# Altium schematic sheet Communication.SchDoc
size A3; SheetNumber: 4; SheetTotal: 5
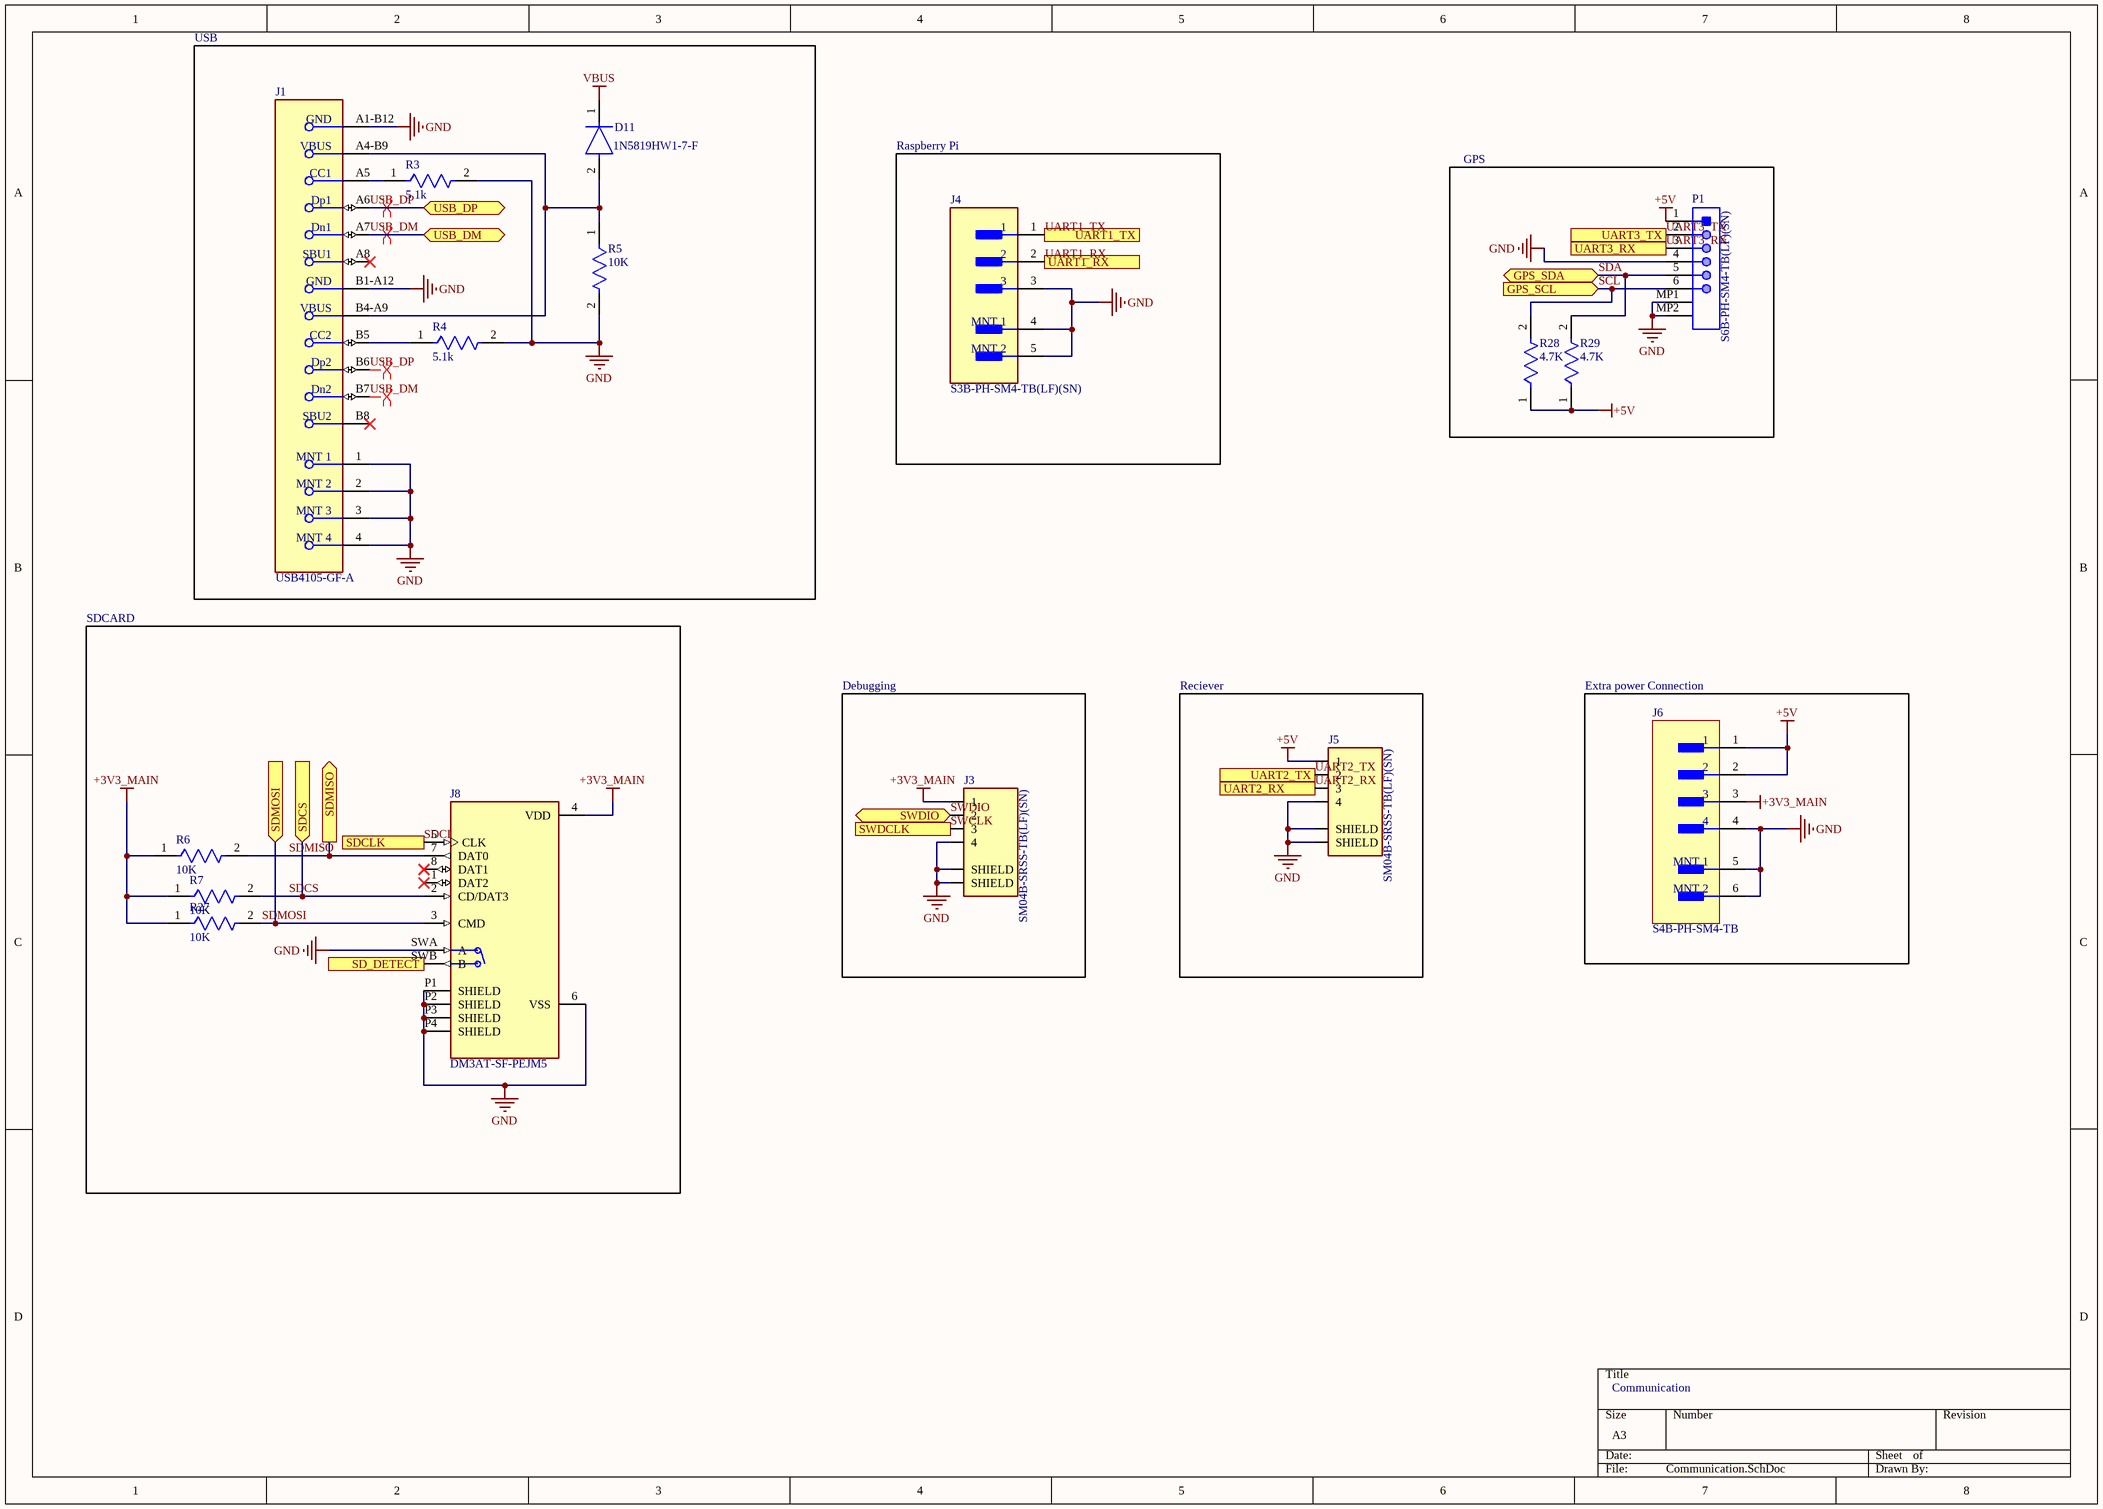
[diagram p0: Communication.SchDoc]

## Parts
D11  1N5819HW1-7-F  [FP-SOD123F_Type_B-MFG]
J1  USB4105-GF-A  [FP-USB4105-GF-A-MFG]
J3  SM04B-SRSS-TB(LF)(SN)  [JST_SM04B-SRSS-TB(LF)(SN)]
J4  S3B-PH-SM4-TB(LF)(SN)  [FP-S3B-PH-SM4-TB_LF_SN-MFG]
J5  SM04B-SRSS-TB(LF)(SN)  [JST_SM04B-SRSS-TB(LF)(SN)]
J6  S4B-PH-SM4-TB  [FP-S4B-PH-SM4-TB-MFG]
J8  DM3AT-SF-PEJM5  [HRS_DM3AT-SF-PEJM5]
P1  S6B-PH-SM4-TB(LF)(SN)  [JST-S6B-PH-SM4-TB(LF)(SN)_V]
R3  5.1k  [FP-RN73R1E-IPC_C]
R4  5.1k  [FP-RN73R1E-IPC_C]
R5  10K  [FP-MCS0402-MFG]
R6  10K  [FP-MCS0402-MFG]
R7  10K  [FP-MCS0402-MFG]
R27  10K  [FP-MCS0402-MFG]
R28  4.7K  [FP-CRCW0402-Pe3-IPC_C]
R29  4.7K  [FP-CRCW0402-Pe3-IPC_C]

## Blocks framed on the sheet
USB: D11 J1 R3-R5
Raspberry Pi: J4
GPS: P1 R28 R29
SDCARD: J8 R6 R7 R27
Debugging: J3
Reciever: J5
Extra power Connection: J6

## Ports
GPS_SCL (in, see EMP_FC_Main[3B], MCU_Core[5B]), GPS_SDA (bidir, see EMP_FC_Main[3B], MCU_Core[5B]), SD_DETECT (out, see EMP_FC_Main[3B], MCU_Core[1B]), SDCLK (in, see EMP_FC_Main[3B], MCU_Core[1B]), SDCS (in, see EMP_FC_Main[3B], MCU_Core[3B]), SDMISO (out, see EMP_FC_Main[3B], MCU_Core[1B]), SDMOSI (in, see EMP_FC_Main[3B], MCU_Core[1B]), SWDCLK (out, see EMP_FC_Main[3B], MCU_Core[4B]), SWDIO (bidir, see EMP_FC_Main[3B], MCU_Core[4B]), UART1_RX (out, see EMP_FC_Main[3B], MCU_Core[3B]), UART1_TX (in, see EMP_FC_Main[3B], MCU_Core[3B]), UART2_RX (out, see EMP_FC_Main[3B], MCU_Core[4B]), UART2_TX (in, see EMP_FC_Main[3B], MCU_Core[4B]), UART3_RX (out, see EMP_FC_Main[3B], MCU_Core[1B]), UART3_TX (in, see EMP_FC_Main[3B], MCU_Core[1B]), USB_DM (bidir, see EMP_FC_Main[3B], MCU_Core[4B]), USB_DP (bidir, see EMP_FC_Main[3B], MCU_Core[4B])

## Nets
+3V3_MAIN: J3.1 J6.3 J8.4(VDD) R6.1 R7.1 R27.1
+5V: J5.1 J6.1 J6.2 P1.1 R28.1 R29.1
GND: J1.1(MNT_1) J1.2(MNT_2) J1.3(MNT_3) J1.4(MNT_4) J1.A1-B12(GND) J1.B1-A12(GND) J3.4 J3.S1(SHIELD) J3.S2(SHIELD) J4.3 J4.4(MNT_1) J4.5(MNT_2) J5.4 J5.S1(SHIELD) J5.S2(SHIELD) J6.4 J6.5(MNT_1) J6.6(MNT_2) J8.6(VSS) J8.P1(SHIELD) J8.P2(SHIELD) J8.P3(SHIELD) J8.P4(SHIELD) J8.SWA(A) P1.4 P1.MP1 P1.MP2 R3.2 R4.2 R5.2
VBUS: D11.1(C)
SCL: P1.6 R28.2 ; port GPS_SCL
SD_DETECT: J8.SWB(B) ; port SD_DETECT
SDA: P1.5 R29.2 ; port GPS_SDA
SDCLK: J8.5(CLK) ; port SDCLK
SDCS: J8.2(CD/DAT3) R7.2 ; port SDCS
SDMISO: J8.7(DAT0) R6.2 ; port SDMISO
SDMOSI: J8.3(CMD) R27.2 ; port SDMOSI
SWCLK: J3.3 ; port SWDCLK
SWDIO: J3.2 ; port SWDIO
UART1_RX: J4.2 ; port UART1_RX
UART1_TX: J4.1 ; port UART1_TX
UART2_RX: J5.3 ; port UART2_RX
UART2_TX: J5.2 ; port UART2_TX
UART3_RX: P1.3 ; port UART3_RX
UART3_TX: P1.2 ; port UART3_TX
USB_DM: J1.A7(Dn1) J1.B7(Dn2) ; port USB_DM
USB_DP: J1.A6(Dp1) J1.B6(Dp2) ; port USB_DP
NetD11_2: D11.2(A) J1.A4-B9(VBUS) J1.B4-A9(VBUS) R5.1
NetJ1_A5: J1.A5(CC1) R3.1
NetJ1_B5: J1.B5(CC2) R4.1

Not connected (* = marked no-connect by the designer): J1 A8(SBU1)* B8(SBU2)*; J8 1(DAT2)* 8(DAT1)*

## Layout directives
differential pair: USB_DM, USB_DP

## Notes on the sheet
- Communication

## Library data of the parts
D11 = CMP-12791-000028-1: DIODE SBR 40V 1A SOD123F; Manufacturer: Diodes Inc.; Max Junction Temp: +125°C; Capacitance: 30pF; Value: 30pF; Peak Reverse Current: 0.5mA; Max Surge Forward Current: 30A; ComponentLink2Description: Datasheet; Temperature: -55°C to +125°C; Lead Free: Yes; Package: SOD123F (Type B); Reverse Voltage: 40V; Device Class L2: Diodes; Manufacturer Part Number: 1N5819HW1-7-F; ComponentLink2URL: https://www.diodes.com/assets/Datasheets/1N5819HW1.pdf; Automotive: No; RoHS: TRUE; Height: 1.15mm; Digikey Description: DIODE SBR 40V 1A SOD123F; Max Repetitive Reverse Voltage: 40V; Forward Current: 1A; Footprint Url: https://www.diodes.com/assets/Package-Files/SOD123F%20(Type%20B).pdf; Temperature Range High: +125°C; Octopart: https://octopart.com/1n5819hw1-7-f-diodes+inc.-67250096; Mouser Description: Schottky Diodes & Rectifiers 1A SBR 40Vrrm 0.51Vf 0.5mA 28Vrms; Device Class L3: Rectifier Diodes; Ipc Land Pattern Name: SOD350180X98-2; Device Class L1: Discrete Semiconductors; Category: Diode; Temperature Range Low: -55°C
J1 = CMP-245163-000001-1: CONN RCPT USB2.0 TYPEC 5A; Manufacturer: GCT; Description: USB - C (Type - C) USB 2.0 Receptacle Connector 24 Position Surface Mount, Right Angle; Through Hole; Voltage Rating: 20V; Is Female: yes; Current Rating: 5/6.25/1.25/0.25A; Number Of Contacts: 16; Conn Orientation: Right Angle; Device Class L1: Connectors; Category: Conn; Lead Free: Yes; RoHS: TRUE; Temperature Range High: +85°C; Digikey Description: CONN RCPT USB2.0 TYPEC 5A; Device Class L3: unset; ComponentLink2Description: Datasheet; Manufacturer Part Number: USB4105-GF-A; Package: 0; Usb Standard: USB 2.0; Device Class L2: USB Connectors; Automotive: No; Temperature Range Low: -40°C; Height: 3.46mm; Temperature: -40°C to +85°C; Contact Material: Gold,Nickel; ComponentLink2URL: https://gct.co/files/drawings/usb4105.pdf; Octopart: https://octopart.com/usb4105-gf-a-gct-106627878
J3 J5 = SM04B-SRSS-TB(LF)(SN): Connector Header Surface Mount, Right Angle 4 position 0.039 (1.00mm); MF: JST Sales; SnapEDA_Link: https://www.snapeda.com/parts/SM04B-SRSS-TB(LF)(SN)/JST/view-part/?ref=snap; Package: None; Value: *; MP: SM04B-SRSS-TB(LF)(SN); Check_prices: https://www.snapeda.com/parts/SM04B-SRSS-TB(LF)(SN)/JST/view-part/?ref=eda
J4 = CMP-2000-07023-2: CONN HEADER SMD R/A 3POS 2MM; Voltage Rating: 100V; Gender: Male; Max Current Rating: 2A; Number of Contacts: 3; Insulation Resistance: 1GR; Contact Resistance: 10mR; Termination: Solder; Orientation: Right Angle; Insulation Color: Natural; Flammability Rating: UL94 V-0; Width: 5mm; Lead Free: Lead Free; Mount: Surface Mount; Max Operating Temperature: 85°C; Connector Type: Header; Fastening Type: Detent; Max Voltage Rating (DC): 100V; Housing Material: Polyamide; Number of Rows: 1; Housing Color: Beige; Contact Plating: Tin; Contact Shape: Square; Working Voltage: 100V; Contact Material: Copper Alloy; Contact Mating Length: 0.13inch; Contact Type: Male Pin; Max Voltage Rating (AC): 100V; Packaging: Tape and Reel; Min Operating Temperature: -25°C; Number of Positions: 3; REACH SVHC: No SVHC; Contact Finish - Mating: TIN; Color: Natural; Length: 9.9mm; Insulation Material: Nylon; Depth: 7.6mm; Current Rating: 2A; Material: Polyamide; Voltage Rating (AC): 100V; Pitch: 2mm; Series: PH; Height: 9.4mm; Number of Poles: 3; Lead Pitch: 2mm
J6 = CMP-00504-08293667-1: S4B-PH-SM4-TB Header S4B-PH-SM4-TB, 2.00mm, 4-contacts, side entry, SMT, /1000/reel; Max Voltage Rating (DC): 100V; Gender: Male; Number of Contacts: 4; Pitch: 2mm; Max Current Rating: 2A; Contact Resistance: 20mΩ; Termination: Solder; Contact Plating: Copper, Tin; Max Voltage Rating (AC): 100V; Number of Pins: 4; Length: 11.9mm; Housing Color: Beige; RoHS: Non-Compliant; Voltage Rating: 100V; Depth: 7.6mm; Height: 5.5mm; Current Rating: 2A; Max Operating Temperature: 85°C; Min Operating Temperature: -25°C; Number of Rows: 1; Housing Material: Polyamide; Contact Material: Copper, Tin; Packaging: Tape and Reel
J8 = DM3AT-SF-PEJM5: 10 (8 + 2) Position Card Connector Secure Digital - microSDâ„¢ Surface Mount, Right Angle Gold; MF: Hirose; SnapEDA_Link: https://www.snapeda.com/parts/DM3AT-SF-PEJM5/Hirose+Electric+Co+Ltd/view-part/?ref=snap; Package: None; Value: *; MP: DM3AT-SF-PEJM5; Check_prices: https://www.snapeda.com/parts/DM3AT-SF-PEJM5/Hirose+Electric+Co+Ltd/view-part/?ref=eda
P1 = CMP-2000-07027-1: Male Header, Pitch 2 mm, 1 x 6 Position, Height 5.5 mm, -25 to 85 degC; Manufacturer: JST; Pitch: 2mm; Style/Orientation: RightAngleHeader/Plug; No of Positions: 6; Package Reference: S6B-PH-SM4-TB(LF)(SN); Type: ShroudedHeader; Package Description: Male Header, Pitch 2 mm, 1 x 6 Position, Height 5.5 mm; Mounting Technology: SurfaceMount; Datasheet Version: 11/2008; Termination: Solder; Datasheet URL: https://datasheet.ciiva.com/11747/0900766b80df0d9d-11747278.pdf; Manufacturer URL: http://www.jst.com/home2.html
R3 R4 = CMP-04015-008529-1: 5.1kΩ ±1% 0.063W, 1/16W Chip Resistor 0402 (1005 Metric) Moisture Resistant Thin Film
R5-R7 R27 = CMP-02407-000363-1: RES SMD 1.2K OHM 1% 1/10W 0402; Power Rating: 100mW; Temperature Coefficient: 25ppm/°C; Tolerance: 0.5%; Voltage Rating: 50V; Resistance: 10kR; Package Quantity: 10000; Case Code (Metric): 1005; Height: 0.015inch; Termination: SMD/SMT; Features: Automotive AEC-Q200; Packaging: Tape and Reel; Length: 0.039inch; Min Operating Temperature: -55°C; Case/Package: 0402; Max Power Dissipation: 100mW; Case Code (Imperial): 0402; Width: 0.5mm; Contact Plating: Tin; Weight: 2.1E-05oz; Max Operating Temperature: 175°C; Composition: Thin Film; Number of Terminations: 2; Radiation Hardening: No
R28 R29 = CMP-03613-000096-1: RES Thick Film, 4.7kΩ, 1%, 0.063W, 50ppm/°C, 0402; Resistance: 4.7kR; Max Power Dissipation: 63mW; Tolerance: 1%; Package Quantity: 10000; Case/Package: 0402; Max Operating Temperature: 155°C; RoHS Compliant: Yes; Series: CRCW-P; Resistor Type: Thick Film; Number of Terminations: 2; Min Operating Temperature: -55°C; Temperature Coefficient: 50ppm/°C; Features: Automotive AEC-Q200; Length: 0.039inch; Height: 0.016inch; Width: 0.02inch; Packaging: Tape and Reel